# Altium schematic sheet 12_I2C.schdoc.schdoc
size 309 x 223 mm; Symbol: Sheet-Symbol_A4; Device: Sheet-Symbol_A4; @Page Name: I2C; @Create Date: 2023-12-01; @Page Count: 12; @Page No: 12; @Project Name: STM32F722RET6; @Schematic Name: 开发板; @Update Date: 2023-12-01; Company: 嘉立创EDA; Page Size: A4; Version: V1.0
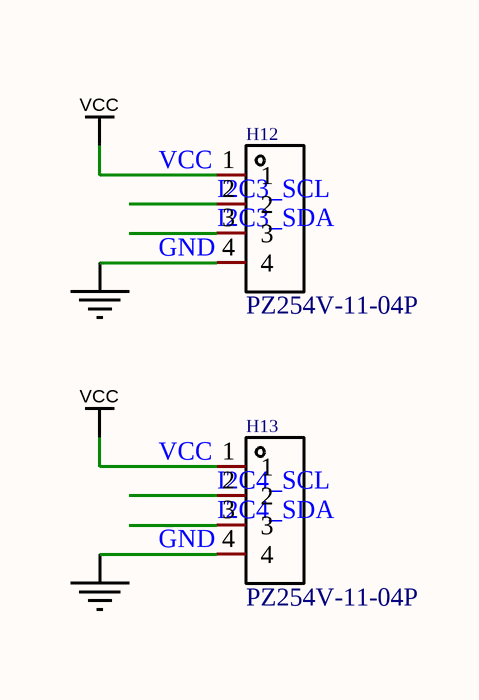
[diagram p0: 12_I2C.schdoc.schdoc]

## Parts
H12  PZ254V-11-04P  [HDR-TH_4P-P2.54-V-M]
H13  PZ254V-11-04P  [HDR-TH_4P-P2.54-V-M]

## Nets
GND: H12.4 H13.4
VCC: H12.1 H13.1
I2C3_SCL: H12.2
I2C3_SDA: H12.3
I2C4_SCL: H13.2
I2C4_SDA: H13.3

## Notes on the sheet
- 1
- 2
- 3
- 4
- 5
- 6
- A
- B
- C
- 原理图
- 开发板
- 创建日期
- 更新日期
- 2023-12-01
- 审阅
- 绘制
- 图页
- I2C
- 物料编码
- STM32F722RET6
- D
- 版本
- 尺寸
- 页
- 12
- 共
- V1.0
- A4
- 嘉立创EDA

## Library data of the parts
H12 H13 = PZ254V-11-04P: 排数:单排;总PIN位数:4P;间距:2.54mm;插针结构:1x4P;行距:-;安装类型:直插;圆针/方针:方针;额定电流:3A;额定电压:250V;配合针长度:6mm;塑高:2.5mm;端接针长度:3mm;触头材质:-;工作温度范围:-40℃~+105℃;颜色:黑色;; Manufacturer: XFCN(兴飞); Symbol: PZ254V-11-04P_C2691448; Add into BOM: yes; Pitch: 2.54mm; Pin Structure: 1x4P; Circluar Pins/Square Pins: 方针; Current Rating (Max): 3A; Voltage Rating (Max): 250V; Name: PZ254V-11-04P; Device: PZ254V-11-04P; LCSC Part Name: 2.54mm 1x4P 直插 方针; Supplier Part: C2691448; Manufacturer Part: PZ254V-11-04P; Supplier Footprint: 插件,P=2.54mm; JLCPCB Part Class: 扩展库; Datasheet: https://atta.szlcsc.com/upload/public/pdf/source/20200309/C492403_F9F19131791D08044AD4F84F8E751A34.pdf; Supplier: LCSC; Convert to PCB: yes; Number of Rows: 单排; Number of Pins: 4P; Row Spacing: -; Mounting Type: 直插; Length of Mating Pin: 6mm; Insulation Height: 2.5mm; Length of End Connection Pin: 3mm; Contact Material: -; Operating Temperature Range: -40℃~+105℃; Color: 黑色